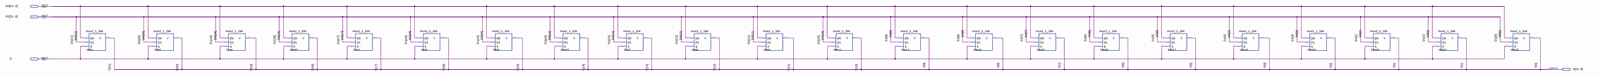
[diagram p0: schematic sheet, whole]
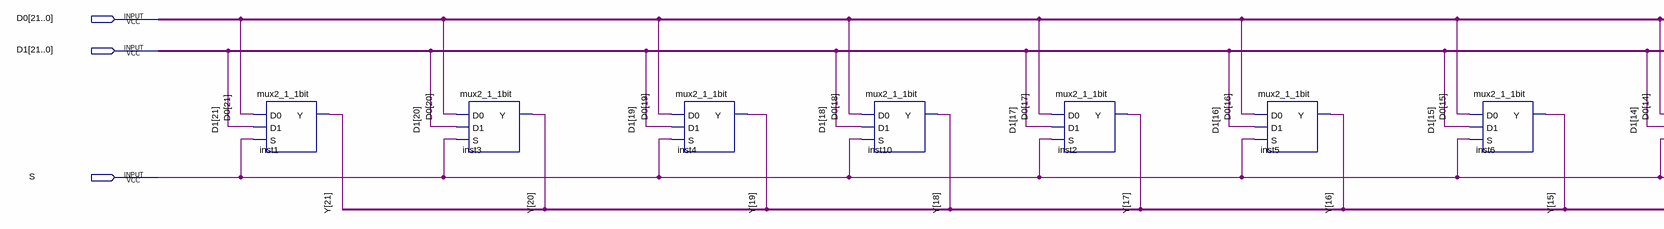
[diagram p1: schematic sheet, left part]
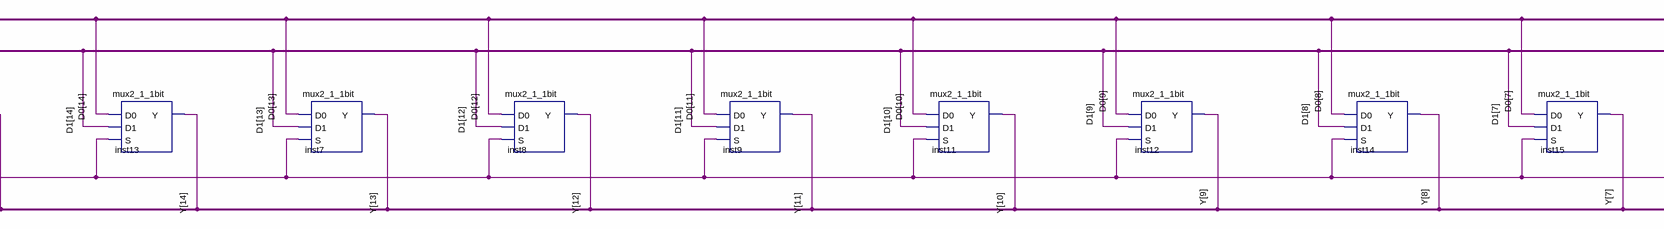
[diagram p2: schematic sheet, centre part]
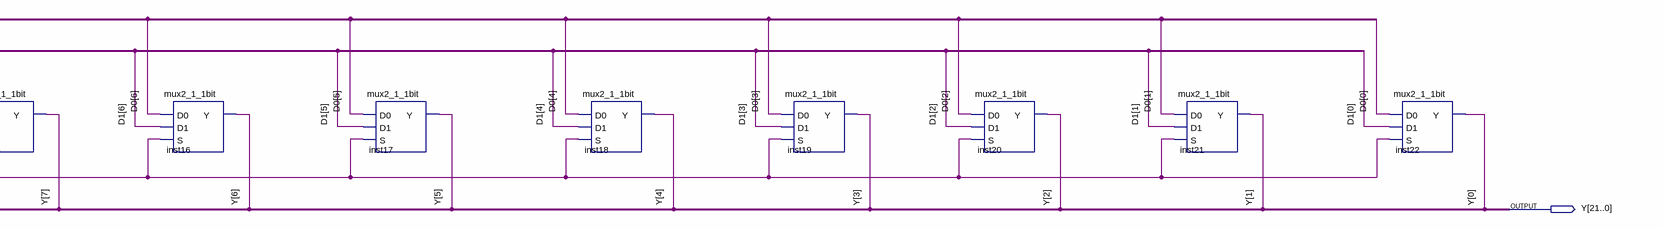
[diagram p3: schematic sheet, right part]
// Quartus schematic mux2_1_22bit.bdf as structural Verilog: 22 symbols, 4 pins
module mux2_1_22bit (
  input  [21:0] D0,
  input  [21:0] D1,
  input  S,
  output [21:0] Y
);

  mux2_1_1bit inst1 (.D0(D0[21]), .D1(D1[21]), .S(S), .Y(Y[21]));
  mux2_1_1bit inst3 (.D0(D0[20]), .D1(D1[20]), .S(S), .Y(Y[20]));
  mux2_1_1bit inst4 (.D0(D0[19]), .D1(D1[19]), .S(S), .Y(Y[19]));
  mux2_1_1bit inst10 (.D0(D0[18]), .D1(D1[18]), .S(S), .Y(Y[18]));
  mux2_1_1bit inst2 (.D0(D0[17]), .D1(D1[17]), .S(S), .Y(Y[17]));
  mux2_1_1bit inst5 (.D0(D0[16]), .D1(D1[16]), .S(S), .Y(Y[16]));
  mux2_1_1bit inst6 (.D0(D0[15]), .D1(D1[15]), .S(S), .Y(Y[15]));
  mux2_1_1bit inst13 (.D0(D0[14]), .D1(D1[14]), .S(S), .Y(Y[14]));
  mux2_1_1bit inst7 (.D0(D0[13]), .D1(D1[13]), .S(S), .Y(Y[13]));
  mux2_1_1bit inst8 (.D0(D0[12]), .D1(D1[12]), .S(S), .Y(Y[12]));
  mux2_1_1bit inst9 (.D0(D0[11]), .D1(D1[11]), .S(S), .Y(Y[11]));
  mux2_1_1bit inst11 (.D0(D0[10]), .D1(D1[10]), .S(S), .Y(Y[10]));
  mux2_1_1bit inst12 (.D0(D0[9]), .D1(D1[9]), .S(S), .Y(Y[9]));
  mux2_1_1bit inst14 (.D0(D0[8]), .D1(D1[8]), .S(S), .Y(Y[8]));
  mux2_1_1bit inst15 (.D0(D0[7]), .D1(D1[7]), .S(S), .Y(Y[7]));
  mux2_1_1bit inst16 (.D0(D0[6]), .D1(D1[6]), .S(S), .Y(Y[6]));
  mux2_1_1bit inst17 (.D0(D0[5]), .D1(D1[5]), .S(S), .Y(Y[5]));
  mux2_1_1bit inst18 (.D0(D0[4]), .D1(D1[4]), .S(S), .Y(Y[4]));
  mux2_1_1bit inst19 (.D0(D0[3]), .D1(D1[3]), .S(S), .Y(Y[3]));
  mux2_1_1bit inst20 (.D0(D0[2]), .D1(D1[2]), .S(S), .Y(Y[2]));
  mux2_1_1bit inst21 (.D0(D0[1]), .D1(D1[1]), .S(S), .Y(Y[1]));
  mux2_1_1bit inst22 (.D0(D0[0]), .D1(D1[0]), .S(S), .Y(Y[0]));
endmodule
